# EAGLE design sensor_4 (EAGLE 7.6.0)
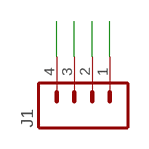
[diagram p0: schematic, sheet 1]

## Parts
J1  M04PTH  [1X04]

## Nets
N$1: J1.4
N$2: J1.3
N$3: J1.2
N$4: J1.1

## Library data of the parts
J1 = SparkFun-Connectors:M04: Header 4 Standard 4-pin 0.1" header. Use with straight break away headers (SKU : PRT-00116), right angle break away headers (PRT-00553), swiss pins (PRT-00743), machine pins (PRT-00117), and female headers (PRT-00115). Molex polarized connector foot print use with SKU : PRT-08231 with associated crimp pins and housings. 1MM SMD Version SKU: PRT-10208; PROD_ID: CONN-09696

## Board
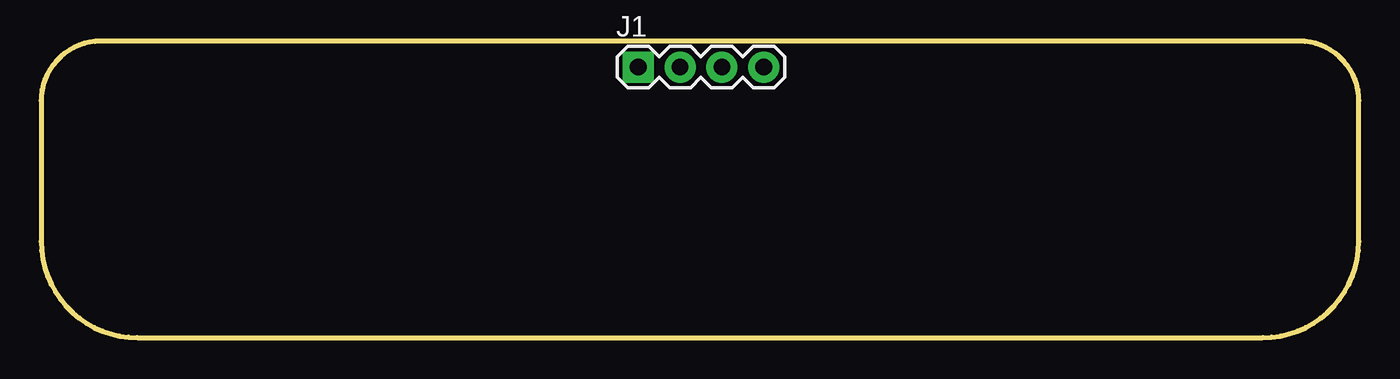
[diagram p1: board, top side]
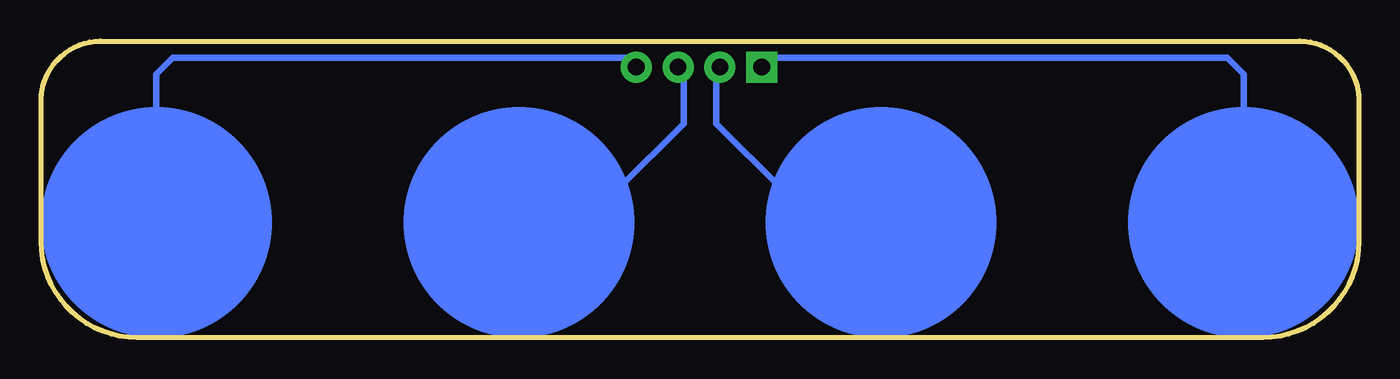
[diagram p2: board, bottom side, seen from below]

Size 80 x 18 mm. Coordinates in mm from the lower left corner, seen from the top.
Outline: 80,5.83 80,14.39 arc90 76.39,18 3.61,18 arc90 0,14.39 0,5.83 arc90 5.83,0 74.17,0 arc90 80,5.83
Copper layers (1*16): Top 0.035mm / dielectric 1.5mm / Bottom 0.035mm
Design rules "default": minimum track width 10mil, minimum drill 24mil, track to track 8mil, track to pad 8mil, pad to pad 8mil, via to via 8mil, smd to smd 8mil, copper to edge 40mil, drill to drill 8mil, minimum pad ring 10mil, minimum via ring 8mil, stop-mask expansion 4mil, vias tented up to drill 0mil, thermal gap 10mil

### Footprints (pad centres in the part's own frame; a part is rotated, then mirrored left to right if it is on the bottom)
1X04 = drill 1.016 pad 1.88 square: 1 0,0 | drill 1.016 pad 1.88: 2 2.54,0; 3 5.08,0; 4 7.62,0

### Placement (x,y rotation side)
J1  36.25,16.43 0 top

### Tracks (layer width: path | path; a pad name or v marks a point on that pad's centre or on a via)
N$5
  Bottom 0.406: 7,14 7,16 8,17 36,17
N$6
  Bottom 0.406: 39,16 39,13 35,9
N$7
  Bottom 0.406: 41,17 41,13 45,9
N$8
  Bottom 0.406: 44,17 72,17 73,16 73,13 74,12
(copper drawn outside any net)
  shapes: Bottom circle x4